# EAGLE design Motherboard_simple (EAGLE 6.1)
DATABASE: ./../../../eagle/PARTSDB.TXT
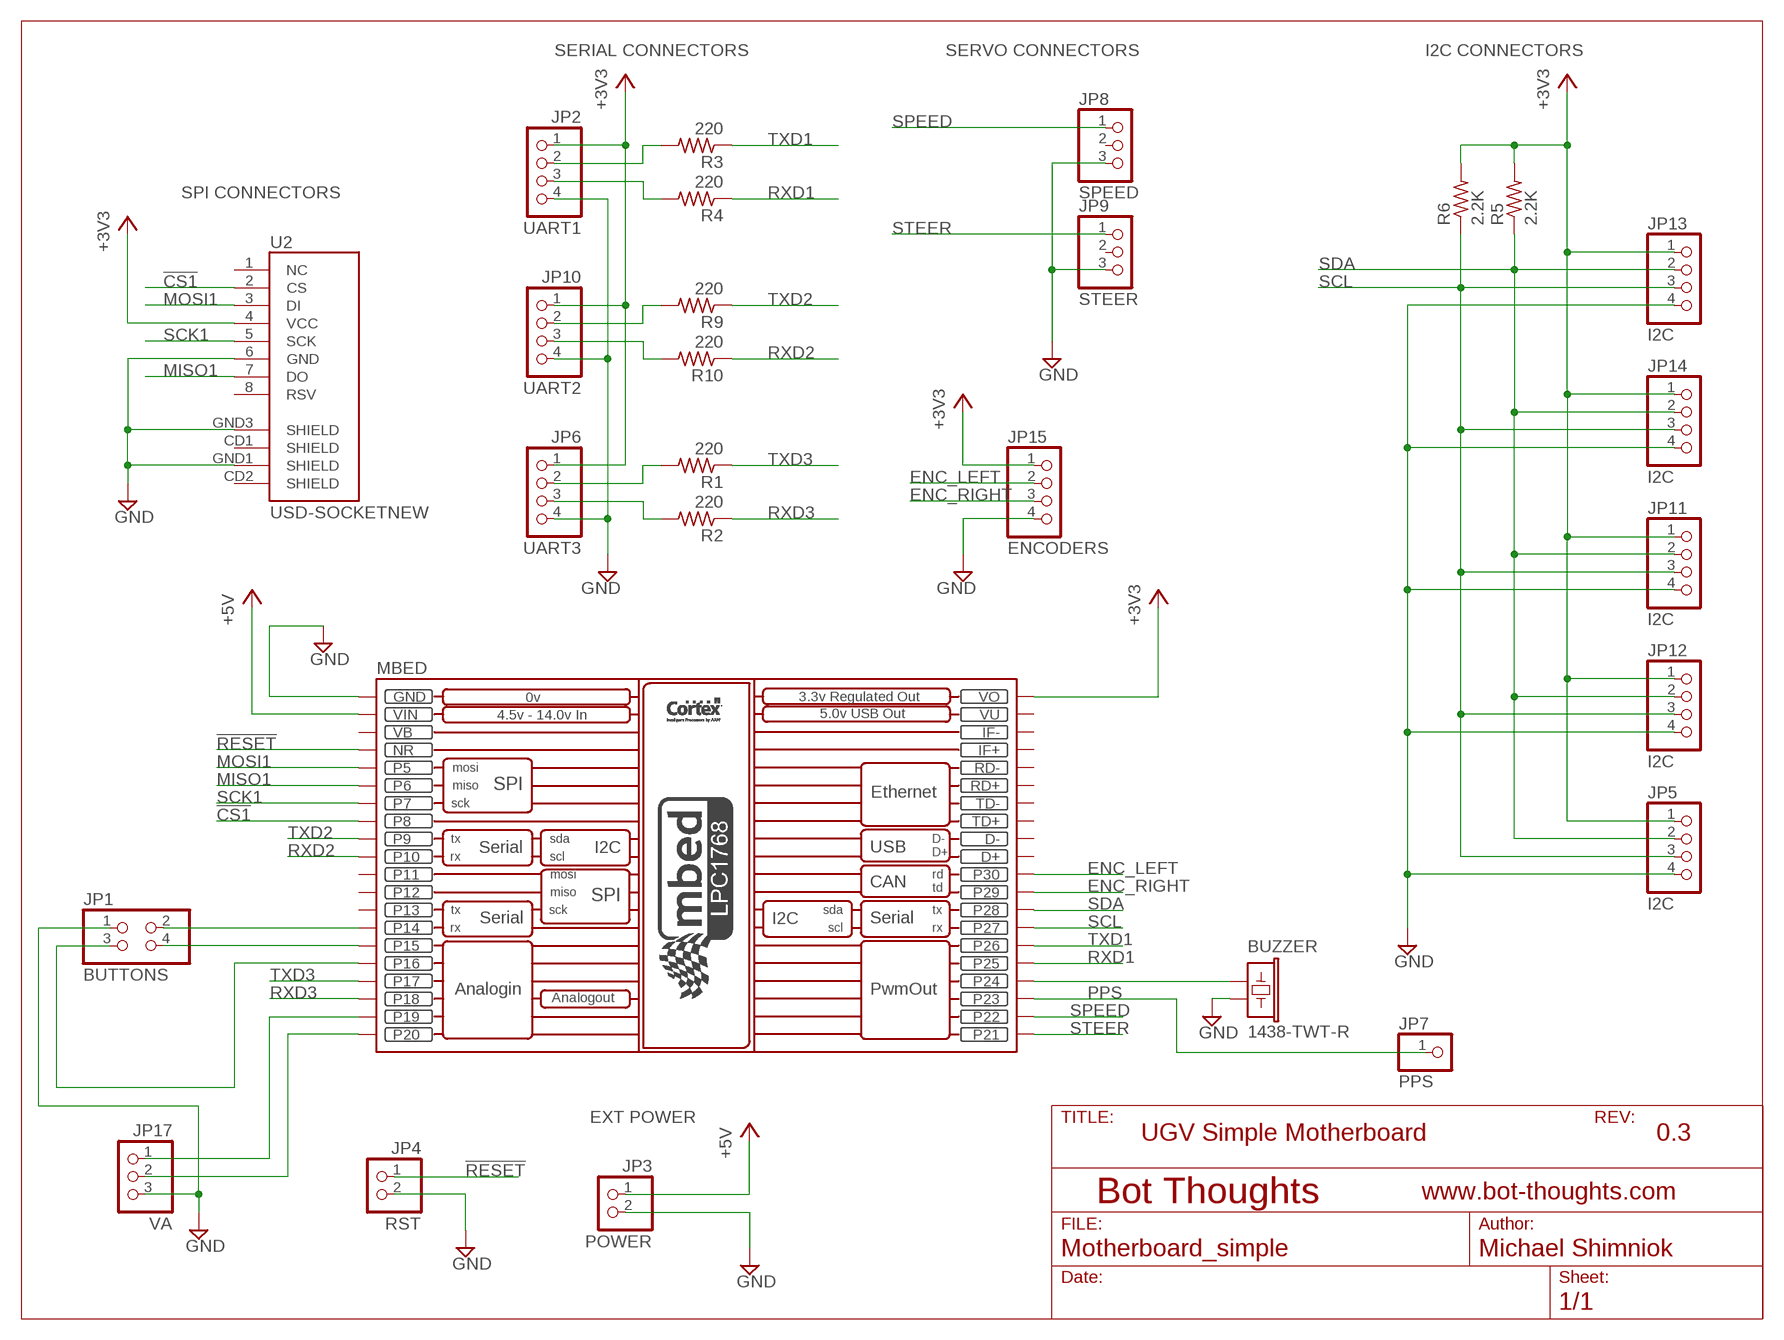
[diagram p0: schematic, sheet 1]

## Parts
BUZZER  1438-TWT-R  BUZZER-AT-1438-TWT-R  [BUZZER_14MM_PTH]
JP1  BUTTONS  PINHD-2X02_2.54  [2X02]
JP2  UART1  PINHD-1X04_2.54-S  [1X04-S]
JP3  POWER  PINHD-1X02_2.54-90°-S  [1X02/90-S]
JP4  RST  PINHD-1X02_2.54-S  [1X02-S]
JP5  I2C  PINHD-1X04_2.54-S  [1X04-S]
JP6  UART3  PINHD-1X04_2.54-S  [1X04-S]
JP7  PPS  PINHD-1X01_2.54-S  [1X01-S]
JP8  SPEED  PINHD-1X03_2.54-S  [1X03-S]
JP9  STEER  PINHD-1X03_2.54-S  [1X03-S]
JP10  UART2  PINHD-1X04_2.54-S  [1X04-S]
JP11  I2C  PINHD-1X04_2.54-S  [1X04-S]
JP12  I2C  PINHD-1X04_2.54-S  [1X04-S]
JP13  I2C  PINHD-1X04_2.54-S  [1X04-S]
JP14  I2C  PINHD-1X04_2.54-S  [1X04-S]
JP15  ENCODERS  PINHD-1X04_2.54-S  [1X04-S]
JP17  VA  PINHD-1X03_2.54-S  [1X03-S]
MBED  MBED_NXP_LPC1768  [MBED-KIT]
R1  220  R-US_0204/5  [0204/5]
R2  220  R-US_0204/5  [0204/5]
R3  220  R-US_0204/5  [0204/5]
R4  220  R-US_0204/5  [0204/5]
R5  2.2K  R-US_0204/5  [0204/5]
R6  2.2K  R-US_0204/5  [0204/5]
R9  220  R-US_0204/5  [0204/5]
R10  220  R-US_0204/5  [0204/5]
U2  USD-SOCKETNEW  [MICRO-SD-SOCKET-PP]

## Nets
!CS1: MBED.P$8(P8) U2.2(CS)
!RESET: JP4.1 MBED.NR
+3V3: JP2.1 JP5.1 JP6.1 JP10.1 JP11.1 JP12.1 JP13.1 JP14.1 JP15.1 MBED.VOUT(VO) R5.2 R6.2 U2.4(VCC)
+5V: JP3.1 MBED.VIN
AMP: JP17.2 MBED.P$20(P20)
ENC_LEFT: JP15.2 MBED.P$30(P30)
ENC_RIGHT: JP15.3 MBED.P$29(P29)
GND: BUZZER.P$2 JP1.1 JP2.4 JP3.2 JP4.2 JP5.4 JP6.4 JP8.3 JP9.3 JP10.4 JP11.4 JP12.4 JP13.4 JP14.4 JP15.4 JP17.3 MBED.GND U2.6(GND) U2.GND1(SHIELD) U2.GND3(SHIELD)
MISO1: MBED.P$6(P6) U2.7(DO)
MOSI1: MBED.P$5(P5) U2.3(DI)
N$1: JP6.2 R1.2
N$2: JP6.3 R2.2
N$5: JP1.2 MBED.P$14(P14)
N$6: JP17.1 MBED.P$19(P19)
N$7: JP1.4 MBED.P$15(P15)
N$8: JP1.3 MBED.P$16(P16)
N$9: JP2.2 R3.2
N$10: JP2.3 R4.2
N$12: BUZZER.P$1 MBED.P$24(P24)
N$16: JP10.2 R9.2
N$17: JP10.3 R10.2
PPS: JP7.1 MBED.P$23(P23)
RXD1: MBED.P$25(P25) R4.1
RXD2: MBED.P$10(P10) R10.1
RXD3: MBED.P$18(P18) R2.1
SCK1: MBED.P$7(P7) U2.5(SCK)
SCL: JP5.3 JP11.3 JP12.3 JP13.3 JP14.3 MBED.P$27(P27) R6.1
SDA: JP5.2 JP11.2 JP12.2 JP13.2 JP14.2 MBED.P$28(P28) R5.1
SPEED: JP8.1 MBED.P$22(P22)
STEER: JP9.1 MBED.P$21(P21)
TXD1: MBED.P$26(P26) R3.1
TXD2: MBED.P$9(P9) R9.1
TXD3: MBED.P$17(P17) R1.1
Unconnected: JP8.2 JP9.2 MBED.D+ MBED.D- MBED.IF+ MBED.IF- MBED.P$11(P11) MBED.P$12(P12) MBED.P$13(P13) MBED.RD+ MBED.RD- MBED.TD+ MBED.TD- U2.1(NC) U2.8(RSV) U2.CD1(SHIELD) U2.CD2(SHIELD)

## Notes on the sheet
- SERIAL CONNECTORS | SERVO CONNECTORS | I2C CONNECTORS
- SPI CONNECTORS
- EXT POWER
- UGV Simple Motherboard | 0.3

## Power pins joined to a net without a drawn wire
VB: MBED.VB
VU: MBED.VU

## Library data of the parts
BUZZER = mes_buzzers:BUZZER: Buzzer 12mm Spark Fun Electronics SKU : Comp-Buzzer; MF: PROJECTS UNLIMITED; MPN: AT-1438-TWT-R; OC_NEWARK: 26K5765
JP1 = pinhead-2:PINHD-2X02: PIN HEADER
JP2 JP5 JP6 JP10-JP15 = pinhead-2:PINHD-1X04: PIN HEADER; OC_NEWARK: unknown
JP3 JP4 = pinhead-2:PINHD-1X02: PIN HEADER; OC_NEWARK: unknown
JP7 = pinhead-2:PINHD-1X01: PIN HEADER
JP8 JP9 JP17 = pinhead-2:PINHD-1X03: PIN HEADER; OC_NEWARK: unknown
MBED = MBED_v2.1:MBED_NXP_LPC1768: Mbed LPC1768 - ARM CORTEX v2.1 * Schematic symbol is now placed in eagles's default raster. *The pads diameter are suitable for routing between mbed pins * mbed pads are 0.8 mm drill diameter. --------------------------------------------- Created by: Mohamed Yousry *Alexandria, Egypt *Email: mohamed.yousry@ieeegoldegypt.org; MPN: 2212S-20SG-85; OC_NEWARK: 08N6778
R1-R4 R9 R10 = rcl:R-US_: RESISTOR, American symbol; MPN: WCR0805-220RFI; OC_NEWARK: 98K2621
R5 R6 = rcl:R-US_: RESISTOR, American symbol; OC_NEWARK: unknown
U2 = SparkFun:USD-SOCKET: microSD Socket Push-push type uSD socket. Schematic element and footprint production proven. Spark Fun Electronics SKU : PRT-00127. tDoc lines correctly indicate media card edge positions when inserting (unlocked, locked, depressed).

## Board
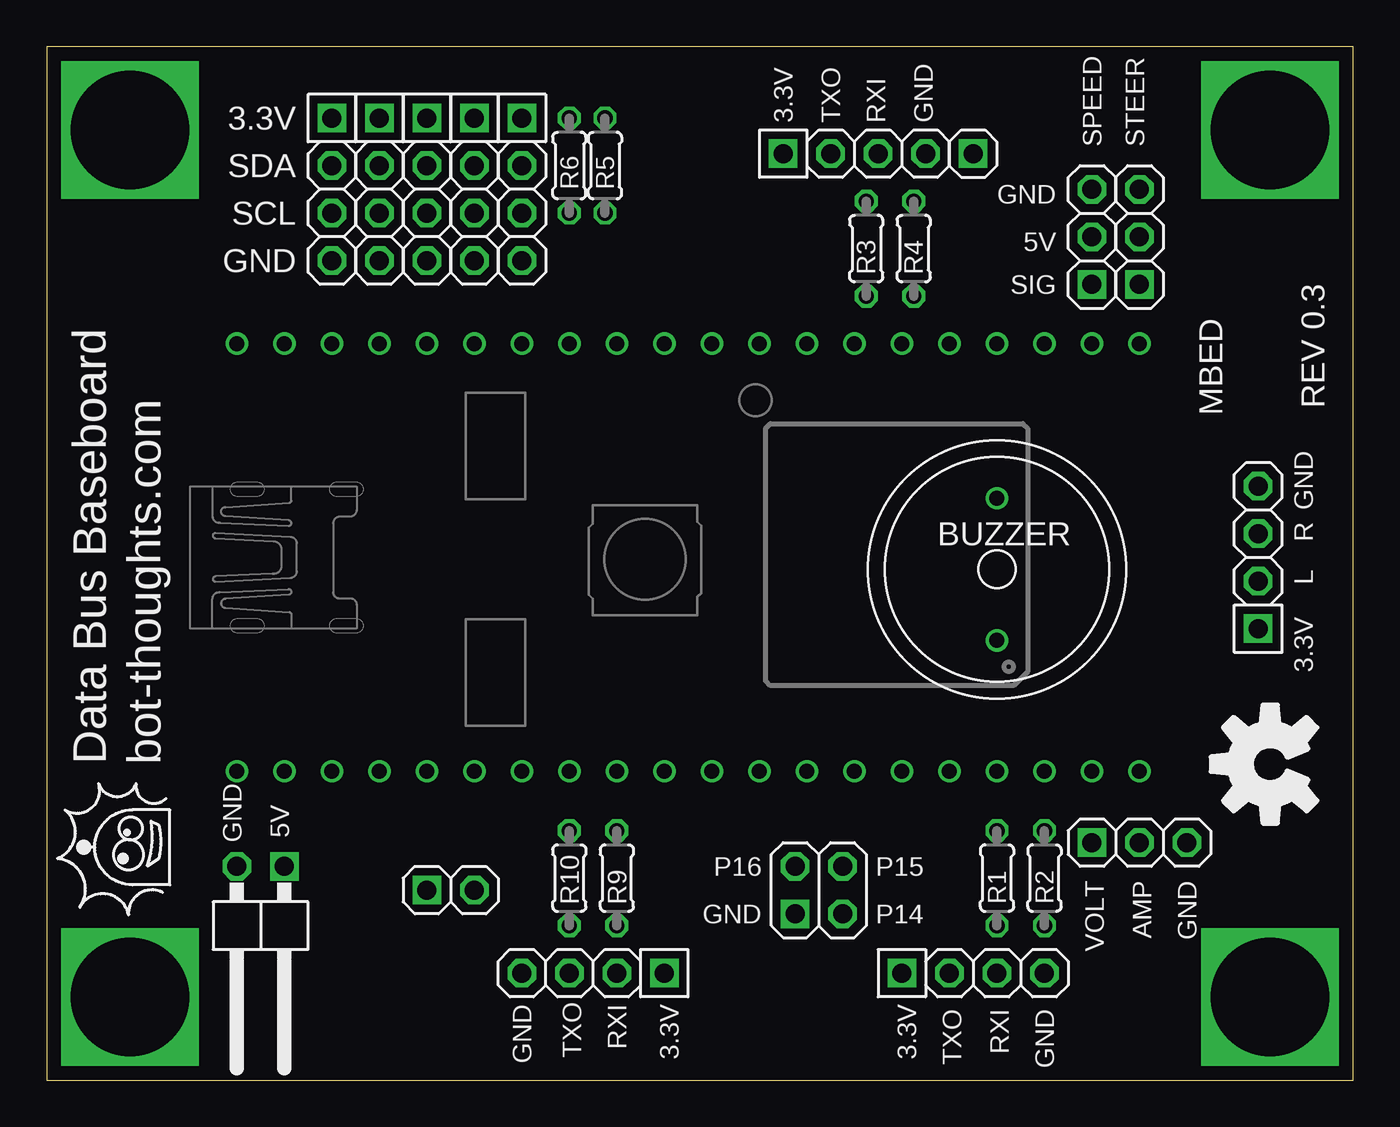
[diagram p1: board, top side]
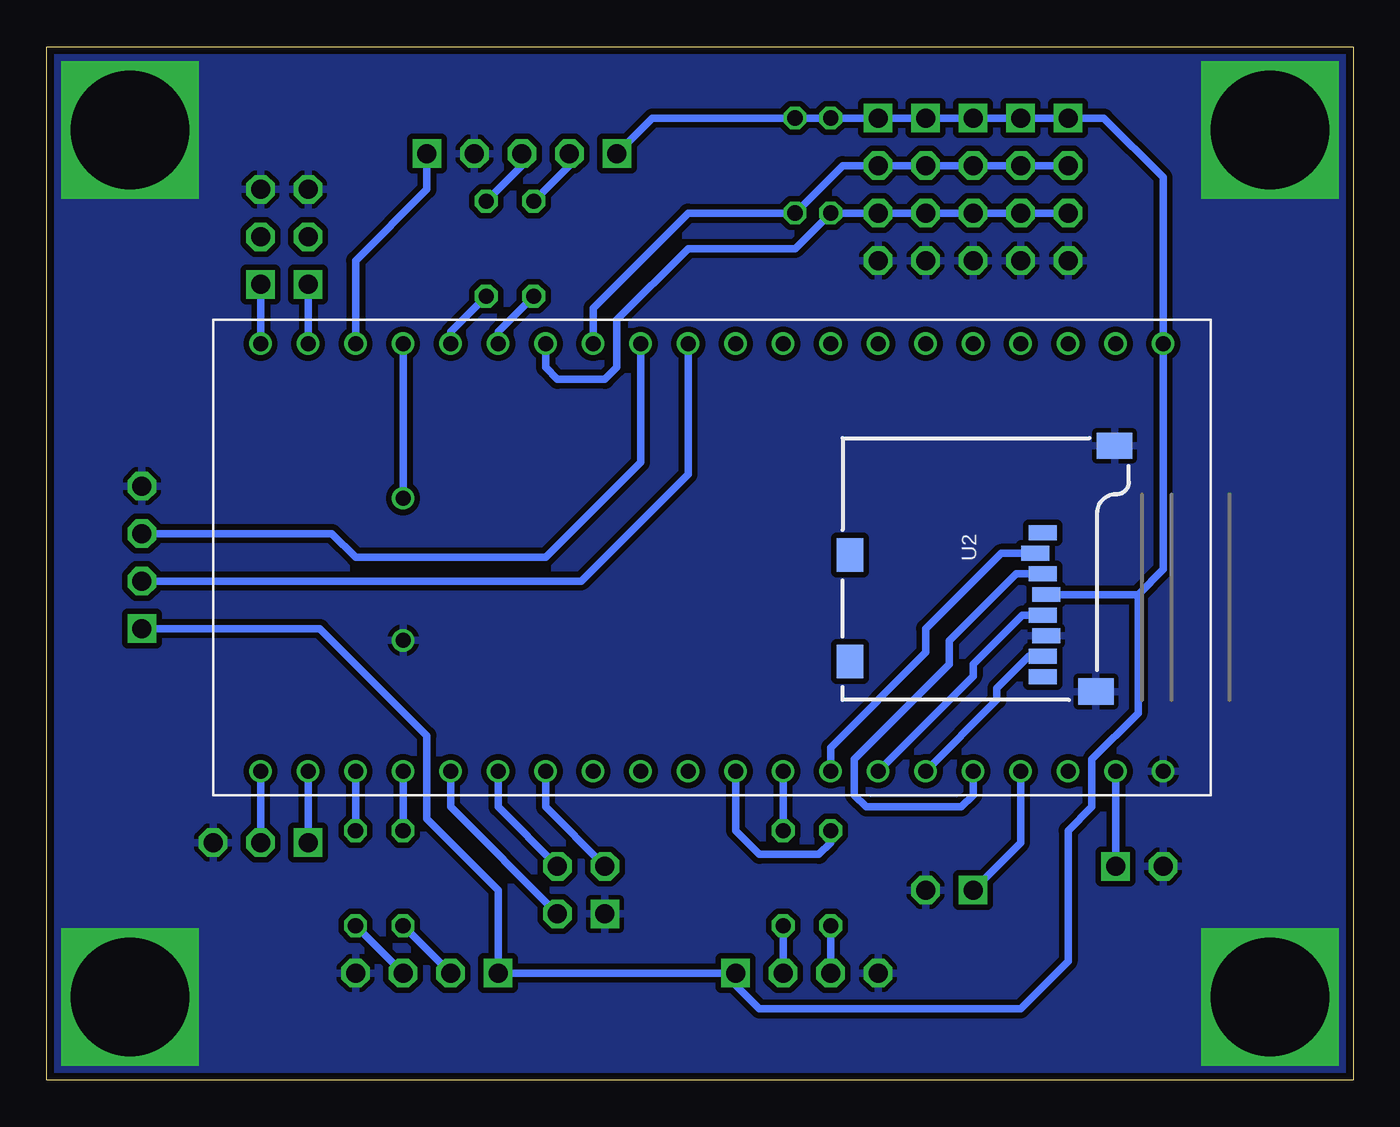
[diagram p2: board, bottom side, seen from below]

Size 69.85 x 55.24 mm. Coordinates in mm from the lower left corner, seen from the top.
Outline: 0,0 69.85,0 69.85,55.24 0,55.24 0,0
Copper layers (1*16): Top 0.0356mm / dielectric 1.5011mm / Bottom 0.0356mm
Design rules: minimum track width 6mil, minimum drill 13mil, track to track 6mil, track to pad 6mil, pad to pad 6mil, via to via 6mil, smd to smd 6mil, copper to edge 15mil, drill to drill 6mil, minimum pad ring 7mil, minimum via ring 7mil, stop-mask expansion 4mil, vias tented up to drill 0mil, thermal gap 10mil

### Footprints (pad centres in the part's own frame; a part is rotated, then mirrored left to right if it is on the bottom)
BUZZER_14MM_PTH = drill 0.8: P$1 0,-3.8; P$2 0,3.8
2X02 = drill 1.016 square: 1 -1.27,-1.27 | drill 1.016 octagon: 2 -1.27,1.27; 3 1.27,-1.27; 4 1.27,1.27
1X04-S = drill 1.016 square: 1 -3.81,0 | drill 1.016 octagon: 2 -1.27,0; 3 1.27,0; 4 3.81,0
1X02/90-S = drill 1.016 square: 1 -2.54,-3.81 | drill 1.016 octagon: 2 0,-3.81
1X02-S = drill 1.016 square: 1 -1.27,0 | drill 1.016 octagon: 2 1.27,0
1X01-S = drill 1.016 square: 1 0,0
1X03-S = drill 1.016 square: 1 -2.54,0 | drill 1.016 octagon: 2 0,0; 3 2.54,0
MBED-KIT = drill 0.8: D+ 11.43,1.27; D- 11.43,3.81; GND -11.43,24.13; IF+ 11.43,16.51; IF- 11.43,19.05; NR -11.43,16.51; P$5 -11.43,13.97; P$6 -11.43,11.43; P$7 -11.43,8.89; P$8 -11.43,6.35; P$9 -11.43,3.81; P$10 -11.43,1.27; P$11 -11.43,-1.27; P$12 -11.43,-3.81; P$13 -11.43,-6.35; P$14 -11.43,-8.89; P$15 -11.43,-11.43; P$16 -11.43,-13.97; P$17 -11.43,-16.51; P$18 -11.43,-19.05; P$19 -11.43,-21.59; P$20 -11.43,-24.13; P$21 11.43,-24.13; P$22 11.43,-21.59; P$23 11.43,-19.05; P$24 11.43,-16.51; P$25 11.43,-13.97; P$26 11.43,-11.43; P$27 11.43,-8.89; P$28 11.43,-6.35; P$29 11.43,-3.81; P$30 11.43,-1.27; RD+ 11.43,11.43; RD- 11.43,13.97; TD+ 11.43,6.35; TD- 11.43,8.89; VB -11.43,19.05; VIN -11.43,21.59; VOUT 11.43,24.13; VU 11.43,21.59
0204/5 = drill 0.813 octagon: 1 -2.54,0; 2 2.54,0
MICRO-SD-SOCKET-PP = smd 0.8 x 1.5: 1 -8.94,10.7; 2 -7.84,10.3; 3 -6.74,10.7; 4 -5.64,10.9; 5 -4.54,10.7; 6 -3.44,10.9; 7 -2.34,10.7; 8 -1.24,10.7 | smd 1.8 x 1.4: CD1 -2.05,0.4; CD2 -7.75,0.4 | smd 1.4 x 1.9: GND1 -13.6,14.55; GND3 -0.45,13.55

### Placement (x,y rotation side)
BUZZER  50.8,27.3 180 top
JP1  41.27,10.16 0 top
JP2  43.18,49.53 0 top
JP3  10.16,7.62 180 top
JP4  21.59,10.16 0 top
JP5  25.4,47.62 270 top
JP6  49.53,5.71 0 top
JP7  49.53,49.53 90 top
JP8  55.88,45.09 90 top
JP9  58.42,45.09 90 top
JP10  29.21,5.71 180 top
JP11  20.32,47.62 270 top
JP12  15.24,47.62 270 top
JP13  22.86,47.62 270 top
JP14  17.78,47.62 270 top
JP15  64.77,27.94 90 top
JP17  58.42,12.7 0 top
MBED  34.29,27.94 90 top
R1  50.8,10.79 270 top
R2  53.34,10.79 270 top
R3  43.81,44.45 90 top
R4  46.35,44.45 90 top
R5  29.84,48.9 90 top
R6  27.94,48.9 90 top
R9  30.48,10.79 270 top
R10  27.94,10.79 270 top
U2  27.3,20.32 270 bottom

### Tracks (layer width: path | path; a pad name or v marks a point on that pad's centre or on a via)
!CS1
  Bottom 0.406: U2.2 18.83,28.16 22.86,24.13 22.86,22.86 27.94,17.78 MBED.P$8
!RESET
  Bottom 0.406: JP4.1 17.78,12.7 MBED.NR
+3V3
  Bottom 0.406: U2.4 11.51,25.96 | 11.51,25.96 10.16,27.3 MBED.VOUT 10.16,48.26 13.34,51.44 JP12.1 JP14.1 JP11.1 JP13.1 JP5.1 R6.2 R5.2 37.47,51.44 JP2.1 | JP15.1 55.24,24.13 49.53,18.41 49.53,13.97 45.72,10.16 JP6.1 JP10.1 33.02,5.08 31.75,3.81 17.78,3.81 15.24,6.35 15.24,13.34 13.97,14.61 13.97,17.14 11.51,19.61 11.51,25.96
+5V
  Bottom 0.406: MBED.VIN JP3.1
AMP
  Bottom 0.406: JP17.2 MBED.P$20
ENC_LEFT
  Bottom 0.406: JP15.2 41.27,26.67 35.56,32.38 MBED.P$30
ENC_RIGHT
  Bottom 0.406: JP15.3 54.61,29.21 53.34,27.94 43.18,27.94 38.1,33.02 MBED.P$29
GND  (via drill 6.35)
  other vias: 4.45,50.8 65.41,50.8 65.41,4.45 4.45,4.45
  pour Bottom (isolate 0.305, rank 3): 0,55.24 69.85,55.24 69.85,0 0,0
MISO1
  Bottom 0.406: U2.7 17.34,22.66 19.05,20.95 19.05,20.32 MBED.P$6
MOSI1
  Bottom 0.406: U2.3 18.02,27.06 21.59,23.5 21.59,22.23 26.67,17.14 26.67,15.24 26.04,14.61 20.95,14.61 20.32,15.24 MBED.P$5
N$1
  Bottom 0.406: JP6.2 R1.2
N$2
  Bottom 0.406: JP6.3 R2.2
N$5
  Bottom 0.406: JP1.2 43.18,14.61 MBED.P$14
N$6
  Bottom 0.406: JP17.1 MBED.P$19
N$7
  Bottom 0.406: JP1.4 45.72,14.61 MBED.P$15
N$8
  Bottom 0.406: JP1.3 48.26,14.61 MBED.P$16
N$9
  Bottom 0.406: JP2.2 41.91,48.9 R3.2
N$10
  Bottom 0.406: JP2.3 44.45,48.9 R4.2
N$12
  Bottom 0.406: MBED.P$24 BUZZER.P$1
N$16
  Bottom 0.406: R9.2 JP10.2
N$17
  Bottom 0.406: JP10.3 R10.2
PPS
  Bottom 0.406: JP7.1 49.53,47.62 53.34,43.81 MBED.P$23
RXD1
  Bottom 0.406: R4.1 48.26,40.01 MBED.P$25
RXD2
  Bottom 0.406: R10.1 27.94,12.7 28.57,12.06 31.75,12.06 33.02,13.34 MBED.P$10
RXD3
  Bottom 0.406: R2.1 MBED.P$18
SCK1
  Bottom 0.406: U2.5 17.68,24.86 20.32,22.23 20.32,21.59 MBED.P$7
SCL
  Bottom 0.406: JP12.3 JP14.3 JP11.3 JP13.3 JP5.3 R6.1 29.84,44.45 35.56,44.45 39.37,40.64 39.37,38.1 40.01,37.47 42.55,37.47 43.18,38.1 MBED.P$27
SDA
  Bottom 0.406: JP12.2 JP14.2 JP11.2 JP13.2 JP5.2 27.3,48.9 R5.1 35.56,46.35 40.64,41.27 MBED.P$28
SPEED
  Bottom 0.406: JP8.1 MBED.P$22
STEER
  Bottom 0.406: JP9.1 MBED.P$21
TXD1
  Bottom 0.406: R3.1 45.72,40.01 MBED.P$26
TXD2
  Bottom 0.406: R9.1 MBED.P$9
TXD3
  Bottom 0.406: R1.1 MBED.P$17

### Text on the board
tNames: 3.3V | 3.3V | TXO | RXI | GND | SDA | SPEED | STEER | GND | SCL | 5V | GND | SIG | REV 0.3 | GND | R | L | 3.3V | Data Bus Baseboard | bot-thoughts.com | GND | 5V | P16 | P15 | VOLT | AMP | GND | GND | P14 | GND | TXO | RXI | 3.3V | 3.3V | TXO | RXI | GND
tDocu: Yes, this is backwards; fix when mounting